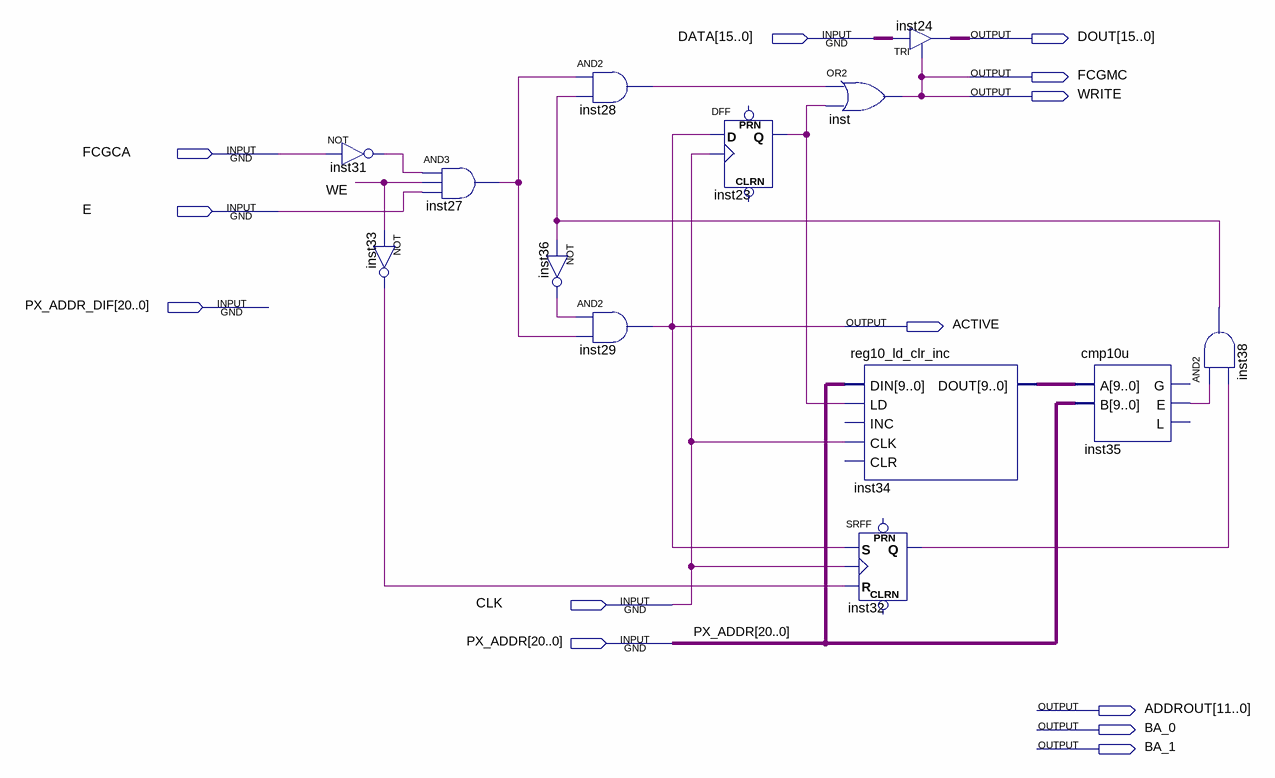
[diagram p0: schematic sheet]
// Quartus schematic wtc.bdf as structural Verilog: 13 symbols, 13 pins
module wtc (
  input  [15:0] DATA,
  input  FCGCA,
  input  E,
  input  [20:0] PX_ADDR_DIF,
  input  CLK,
  input  [20:0] PX_ADDR,
  output [15:0] DOUT,
  output FCGMC,
  output WRITE,
  output ACTIVE,
  output [11:0] ADDROUT,
  output BA_0,
  output BA_1
);

  wire inst23_q, inst27_out, inst28_out, inst31_out, inst32_q, inst33_out, inst35_e, inst36_out, inst38_out,
       WE;
  wire [9:0] inst34_dout;

  not inst31 (inst31_out, FCGCA);
  and inst27 (inst27_out, inst31_out, WE, E);
  not inst33 (inst33_out, WE);
  and inst28 (inst28_out, inst27_out, inst38_out);
  not inst36 (inst36_out, inst38_out);
  and inst29 (ACTIVE, inst36_out, inst27_out);
  DFF inst23 (.CLK(CLK), .D(ACTIVE), .Q(inst23_q));  // open: CLRN, PRN
  TRI inst24[15:0] (.IN(DATA), .OE(FCGMC), .OUT(DOUT));
  or inst (FCGMC, inst28_out, inst23_q);
  reg10_ld_clr_inc inst34 (.DIN(PX_ADDR[20:11]), .LD(inst23_q), .CLK(CLK), .DOUT(inst34_dout));  // open: INC, CLR
  SRFF inst32 (.S(ACTIVE), .R(inst33_out), .CLK(CLK), .Q(inst32_q));  // open: PRN, CLRN
  cmp10u inst35 (.A(inst34_dout), .B(PX_ADDR[20:11]), .E(inst35_e));  // open: G, L
  and inst38 (inst38_out, inst35_e, inst32_q);

  assign WRITE = FCGMC;
endmodule
